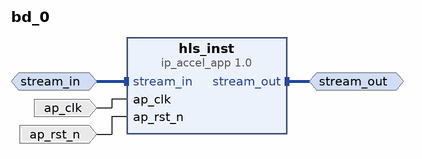
[diagram p0: block diagram of the top level]
# Vivado block design bd_0, xc7z020clg400-1, Vivado 2019.2.1
create_bd_design bd_0

create_bd_intf_port -mode Slave -vlnv xilinx.com:interface:axis_rtl:1.0 stream_in
set_property -dict [list \
  CONFIG.TDATA_NUM_BYTES 4 \
  CONFIG.TDEST_WIDTH 1 \
  CONFIG.TID_WIDTH 1 \
  CONFIG.TUSER_WIDTH 1 \
  CONFIG.HAS_TREADY 1 \
  CONFIG.HAS_TSTRB 1 \
  CONFIG.HAS_TKEEP 1 \
  CONFIG.HAS_TLAST 1 \
  CONFIG.FREQ_HZ 20000000.0 \
  CONFIG.LAYERED_METADATA undef \
] [get_bd_intf_ports stream_in]
create_bd_intf_port -mode Master -vlnv xilinx.com:interface:axis_rtl:1.0 stream_out
set_property -dict {CONFIG.FREQ_HZ 20000000.0} [get_bd_intf_ports stream_out]
create_bd_port -dir I -type clk ap_clk
set_property -dict {CONFIG.FREQ_HZ 20000000.0} [get_bd_ports ap_clk]
create_bd_port -dir I -type rst ap_rst_n

create_bd_cell -type ip -vlnv xilinx.com:hls:ip_accel_app:1.0 hls_inst

# ---- connections ----

connect_bd_intf_net -intf_net stream_in_0_1 [get_bd_intf_ports stream_in] [get_bd_intf_pins hls_inst/stream_in]
connect_bd_intf_net [get_bd_intf_ports stream_out] [get_bd_intf_pins hls_inst/stream_out]
connect_bd_net -net ap_clk_0_1 [get_bd_ports ap_clk] [get_bd_pins hls_inst/ap_clk]
connect_bd_net -net ap_rst_n_0_1 [get_bd_ports ap_rst_n] [get_bd_pins hls_inst/ap_rst_n]

validate_bd_design
save_bd_design
